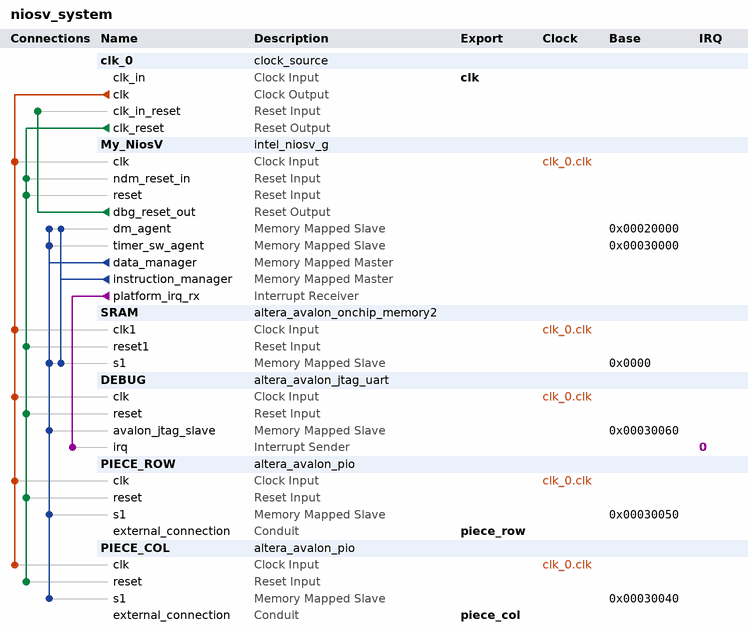
[diagram p0: system contents]
# Platform Designer (Qsys) system niosv_system, Cyclone IV E EP4CE115F29C7
# Parameters at their usual value, and those the tool derives, are not listed.
package require -exact qsys 25.1
create_system niosv_system
set_project_property DEVICE_FAMILY {Cyclone IV E}
set_project_property DEVICE EP4CE115F29C7

add_instance clk_0 clock_source 25.1
set_instance_parameter_value clk_0 clockFrequency 50000000

add_instance My_NiosV intel_niosv_g 4.0.0
set_instance_parameter_value My_NiosV Blind_Window_Period 1000
set_instance_parameter_value My_NiosV CLICenabledInterruptMode 0
set_instance_parameter_value My_NiosV CLICenabledShadowRegisterFiles 1
set_instance_parameter_value My_NiosV Default_Timeout_Period 255
set_instance_parameter_value My_NiosV alignCLICVectorTable 8
set_instance_parameter_value My_NiosV basicInterruptMode 0
set_instance_parameter_value My_NiosV basicShadowRegisterFiles 0
set_instance_parameter_value My_NiosV clockFrequency 50000000
set_instance_parameter_value My_NiosV dataCacheSize 4096
set_instance_parameter_value My_NiosV disableFsqrtFdiv false
set_instance_parameter_value My_NiosV dtcm1Base 0
set_instance_parameter_value My_NiosV dtcm1Size 0
set_instance_parameter_value My_NiosV dtcm2Base 0
set_instance_parameter_value My_NiosV dtcm2Size 0
set_instance_parameter_value My_NiosV enableBranchPrediction true
set_instance_parameter_value My_NiosV enableCLICInterruptEdgeTriggerConfig false
set_instance_parameter_value My_NiosV enableCLICInterruptPolarityConfig false
set_instance_parameter_value My_NiosV enableCLICSelectiveHardwareVectoring false
set_instance_parameter_value My_NiosV enableCoreLevelInterruptController false
set_instance_parameter_value My_NiosV enableDebug true
set_instance_parameter_value My_NiosV enableDebugReset true
set_instance_parameter_value My_NiosV enableECCFull false
set_instance_parameter_value My_NiosV enableECCLite false
set_instance_parameter_value My_NiosV enableFPU false
set_instance_parameter_value My_NiosV enableLockstep false
set_instance_parameter_value My_NiosV enableLockstepExtRst false
set_instance_parameter_value My_NiosV enableMulDiv true
set_instance_parameter_value My_NiosV hartId 0
set_instance_parameter_value My_NiosV instCacheSize 4096
set_instance_parameter_value My_NiosV itcm1Base 0
set_instance_parameter_value My_NiosV itcm1Size 0
set_instance_parameter_value My_NiosV itcm2Base 0
set_instance_parameter_value My_NiosV itcm2Size 0
set_instance_parameter_value My_NiosV numCLICDebugTriggers 0
set_instance_parameter_value My_NiosV numCLICLevels 2
set_instance_parameter_value My_NiosV numCLICPlatformInterrupts 16
set_instance_parameter_value My_NiosV numCLICPriorities 8
set_instance_parameter_value My_NiosV peripheralRegionABase 196608
set_instance_parameter_value My_NiosV peripheralRegionASize 4096
set_instance_parameter_value My_NiosV peripheralRegionBBase 0
set_instance_parameter_value My_NiosV peripheralRegionBSize 0
set_instance_parameter_value My_NiosV resetOffset 0
set_instance_parameter_value My_NiosV resetSlave SRAM.s1
set_instance_parameter_value My_NiosV useResetReq false

add_instance SRAM altera_avalon_onchip_memory2 25.1
set_instance_parameter_value SRAM dataWidth 32
set_instance_parameter_value SRAM dualPort false
set_instance_parameter_value SRAM initMemContent true
set_instance_parameter_value SRAM initializationFileName onchip_mem.hex
set_instance_parameter_value SRAM memorySize 131072

add_instance DEBUG altera_avalon_jtag_uart 25.1
set_instance_parameter_value DEBUG simInteractiveOptions NO_INTERACTIVE_WINDOWS

add_instance PIECE_ROW altera_avalon_pio 25.1
set_instance_parameter_value PIECE_ROW direction Output
set_instance_parameter_value PIECE_ROW width 3

add_instance PIECE_COL altera_avalon_pio 25.1
set_instance_parameter_value PIECE_COL direction Output
set_instance_parameter_value PIECE_COL width 3

# connections
add_connection clk_0.clk DEBUG.clk clock
add_connection clk_0.clk My_NiosV.clk clock
add_connection clk_0.clk PIECE_COL.clk clock
add_connection clk_0.clk PIECE_ROW.clk clock
add_connection clk_0.clk SRAM.clk1 clock
add_connection clk_0.clk_reset DEBUG.reset reset
add_connection clk_0.clk_reset My_NiosV.ndm_reset_in reset
add_connection clk_0.clk_reset My_NiosV.reset reset
add_connection clk_0.clk_reset PIECE_COL.reset reset
add_connection clk_0.clk_reset PIECE_ROW.reset reset
add_connection clk_0.clk_reset SRAM.reset1 reset
add_connection My_NiosV.dbg_reset_out clk_0.clk_in_reset reset
add_connection My_NiosV.data_manager DEBUG.avalon_jtag_slave avalon
set_connection_parameter_value My_NiosV.data_manager/DEBUG.avalon_jtag_slave baseAddress 0x00030060
add_connection My_NiosV.data_manager My_NiosV.dm_agent avalon
set_connection_parameter_value My_NiosV.data_manager/My_NiosV.dm_agent baseAddress 0x00020000
add_connection My_NiosV.data_manager My_NiosV.timer_sw_agent avalon
set_connection_parameter_value My_NiosV.data_manager/My_NiosV.timer_sw_agent baseAddress 0x00030000
add_connection My_NiosV.data_manager PIECE_COL.s1 avalon
set_connection_parameter_value My_NiosV.data_manager/PIECE_COL.s1 baseAddress 0x00030040
add_connection My_NiosV.data_manager PIECE_ROW.s1 avalon
set_connection_parameter_value My_NiosV.data_manager/PIECE_ROW.s1 baseAddress 0x00030050
add_connection My_NiosV.data_manager SRAM.s1 avalon
set_connection_parameter_value My_NiosV.data_manager/SRAM.s1 baseAddress 0x0000
add_connection My_NiosV.instruction_manager My_NiosV.dm_agent avalon
set_connection_parameter_value My_NiosV.instruction_manager/My_NiosV.dm_agent baseAddress 0x00020000
add_connection My_NiosV.instruction_manager SRAM.s1 avalon
set_connection_parameter_value My_NiosV.instruction_manager/SRAM.s1 baseAddress 0x0000
add_connection My_NiosV.platform_irq_rx DEBUG.irq interrupt
set_connection_parameter_value My_NiosV.platform_irq_rx/DEBUG.irq irqNumber 0

# exported interfaces
add_interface clk clock sink
set_interface_property clk EXPORT_OF clk_0.clk_in
add_interface piece_col conduit end
set_interface_property piece_col EXPORT_OF PIECE_COL.external_connection
add_interface piece_row conduit end
set_interface_property piece_row EXPORT_OF PIECE_ROW.external_connection

set_interconnect_requirement {$system} qsys_mm.clockCrossingAdapter HANDSHAKE
set_interconnect_requirement {$system} qsys_mm.enableEccProtection FALSE
set_interconnect_requirement {$system} qsys_mm.insertDefaultSlave FALSE
set_interconnect_requirement {$system} qsys_mm.maxAdditionalLatency 1

save_system niosv_system.qsys
